# Altium schematic sheet Connectors_1.SchDoc: Extension connectors
size A3; DocumentNumber: MB1137; Revision: B-01; SheetNumber: 6; SheetTotal: 6; Project: NUCLEO-XXXXZX
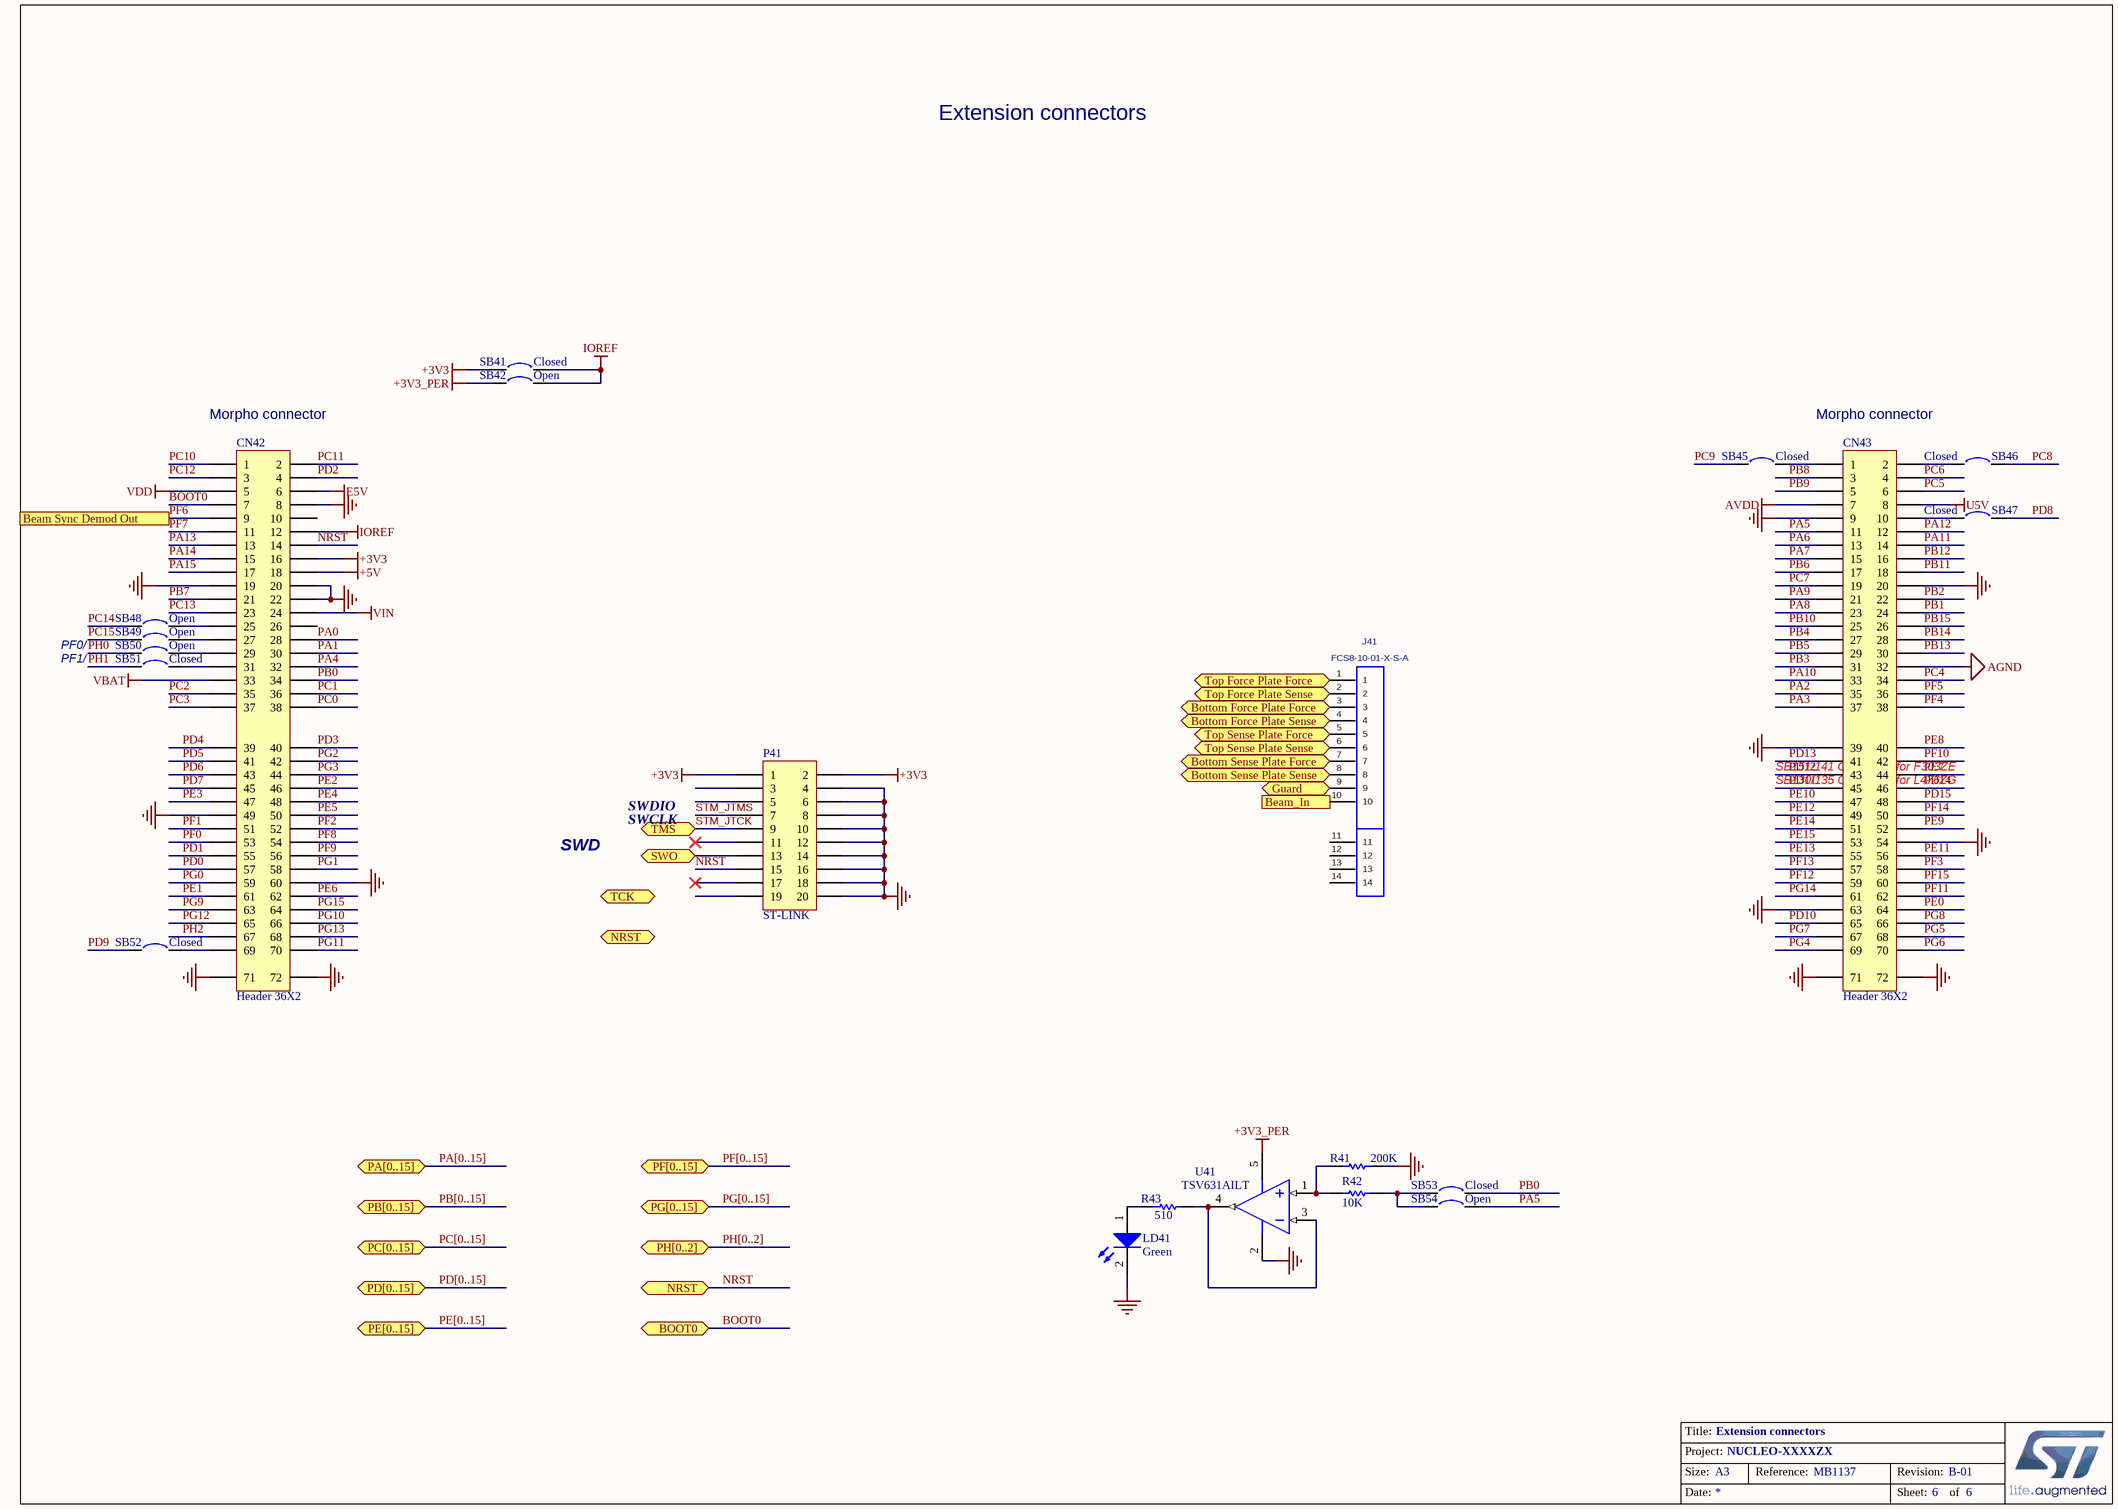
[diagram p0: Connectors_1.SchDoc]

## Parts
CN42  Header 36X2  [HDR_2x36_2R54_V_M]
CN43  Header 36X2  [HDR_2x36_2R54_V_M]
J41  FCS8-10-01-X-S-A  [FCS8-10-01-X-S-A]
LD41  Green  [0603D-G]
P41  ST-LINK  [HDR2X10]
R41  200K  [0603R]
R42  10K  [0603R]
R43  510  [0603R]
SB41  Closed  [SB_0603]
SB42  Open  [SB_0603]
SB45  Closed  [SB_0603]
SB46  Closed  [SB_0603]
SB47  Closed  [SB_0603]
SB48  Open  [SB_0603]
SB49  Open  [SB_0603]
SB50  Open  [SB_0603]
SB51  Closed  [SB_0603]
SB52  Closed  [SB_0603]
SB53  Closed  [SB_0603]
SB54  Open  [SB_0603]
U41  TSV631AILT  [SOT-23-5L]

## Ports
Beam Sync Demod Out, Beam_In, BOOT0, Bottom Force Plate Force, Bottom Force Plate Sense, Bottom Sense Plate Force, Bottom Sense Plate Sense, Guard, NRST, PA[0..15] (bidir), PB[0..15] (bidir), PC[0..15] (bidir), PD[0..15] (bidir), PE[0..15] (bidir), PF[0..15] (bidir), PG[0..15] (bidir), PH[0..2] (bidir), SWO, TCK, TMS, Top Force Plate Force, Top Force Plate Sense, Top Sense Plate Force, Top Sense Plate Sense

## Nets
+3V3: CN42.16 P41.1 P41.2 SB41.1
+3V3_PER: SB42.1 U41.5(VCC)
+5V: CN42.18
AGND: CN43.32
AVDD: CN43.7
E5V: CN42.6
GND: CN42.8 CN42.19 CN42.20 CN42.22 CN42.49 CN42.60 CN42.71 CN42.72 CN43.9 CN43.20 CN43.39 CN43.54 CN43.63 CN43.71 CN43.72 LD41.2(K) P41.4 P41.6 P41.8 P41.10 P41.12 P41.14 P41.16 P41.18 P41.20 R41.2 U41.2(VDD)
IOREF: CN42.12 SB41.2 SB42.2
U5V: CN43.8
VBAT: CN42.33
VDD: CN42.5
VIN: CN42.24
Beam_In: J41.10 ; port Beam_In
BOOT0: CN42.7 ; port BOOT0
Bottom Force Plate Force: J41.3 ; port Bottom Force Plate Force
Bottom Force Plate Sense: J41.4 ; port Bottom Force Plate Sense
Bottom Sense Plate Force: J41.7 ; port Bottom Sense Plate Force
Bottom Sense Plate Sense: J41.8 ; port Bottom Sense Plate Sense
Guard: J41.9 ; port Guard
NRST: CN42.14 P41.15 ; port NRST
PA0: CN42.28
PA1: CN42.30
PA2: CN43.35
PA3: CN43.37
PA4: CN42.32
PA5: CN43.11 SB54.2
PA6: CN43.13
PA7: CN43.15
PA8: CN43.23
PA9: CN43.21
PA10: CN43.33
PA11: CN43.14
PA12: CN43.12
PA13: CN42.13
PA14: CN42.15
PA15: CN42.17
PB0: CN42.34 SB53.1
PB1: CN43.24
PB2: CN43.22
PB3: CN43.31
PB4: CN43.27
PB5: CN43.29
PB6: CN43.17
PB7: CN42.21
PB8: CN43.3
PB9: CN43.5
PB10: CN43.25
PB11: CN43.18
PB12: CN43.16
PB13: CN43.30
PB14: CN43.28
PB15: CN43.26
PC0: CN42.38
PC1: CN42.36
PC2: CN42.35
PC3: CN42.37
PC4: CN43.34
PC5: CN43.6
PC6: CN43.4
PC7: CN43.19
PC8: SB46.1
PC9: SB45.1
PC10: CN42.1
PC11: CN42.2
PC12: CN42.3
PC13: CN42.23
PC14: SB48.1
PC15: SB49.1
PD0: CN42.57
PD1: CN42.55
PD2: CN42.4
PD3: CN42.40
PD4: CN42.39
PD5: CN42.41
PD6: CN42.43
PD7: CN42.45
PD8: SB47.2
PD9: SB52.1
PD10: CN43.65
PD11: CN43.45
PD12: CN43.43
PD13: CN43.41
PD14: CN43.46
PD15: CN43.48
PE0: CN43.64
PE1: CN42.61
PE2: CN42.46
PE3: CN42.47
PE4: CN42.48
PE5: CN42.50
PE6: CN42.62
PE7: CN43.44
PE8: CN43.40
PE9: CN43.52
PE10: CN43.47
PE11: CN43.56
PE12: CN43.49
PE13: CN43.55
PE14: CN43.51
PE15: CN43.53
PF0: CN42.53
PF1: CN42.51
PF2: CN42.52
PF3: CN43.58
PF4: CN43.38
PF5: CN43.36
PF6: CN42.9 ; port Beam Sync Demod Out
PF7: CN42.11
PF8: CN42.54
PF9: CN42.56
PF10: CN43.42
PF11: CN43.62
PF12: CN43.59
PF13: CN43.57
PF14: CN43.50
PF15: CN43.60
PG0: CN42.59
PG1: CN42.58
PG2: CN42.42
PG3: CN42.44
PG4: CN43.69
PG5: CN43.68
PG6: CN43.70
PG7: CN43.67
PG8: CN43.66
PG9: CN42.63
PG10: CN42.66
PG11: CN42.70
PG12: CN42.65
PG13: CN42.68
PG14: CN43.61
PG15: CN42.64
PH0: SB50.1
PH1: SB51.1
PH2: CN42.67
STM_JTCK: P41.9 ; port TMS
STM_JTMS: P41.7
SWO: P41.13 ; port SWO
Top Force Plate Force: J41.1 ; port Top Force Plate Force
Top Force Plate Sense: J41.2 ; port Top Force Plate Sense
Top Sense Plate Force: J41.5 ; port Top Sense Plate Force
Top Sense Plate Sense: J41.6 ; port Top Sense Plate Sense
NetCN42_25: CN42.25 SB48.2
NetCN42_27: CN42.27 SB49.2
NetCN42_29: CN42.29 SB50.2
NetCN42_31: CN42.31 SB51.2
NetCN42_69: CN42.69 SB52.2
NetCN43_1: CN43.1 SB45.2
NetCN43_2: CN43.2 SB46.2
NetCN43_10: CN43.10 SB47.1
NetLD41_1: LD41.1(A) R43.2
NetR41_1: R41.1 R42.1 U41.1(IN+)
NetR42_2: R42.2 SB53.2 SB54.1
NetR43_1: R43.1 U41.3(IN-) U41.4(OUT)

Not connected (* = marked no-connect by the designer): CN42 10 26; J41 11 12 13 14; P41 3 5 11* 17* 19

## Buses and harness runs
bus PA[0..15] = port PA[0..15]
bus PB[0..15] = port PB[0..15]
bus PC[0..15] = port PC[0..15]
bus PD[0..15] = port PD[0..15]
bus PE[0..15] = port PE[0..15]
bus PF[0..15] = port PF[0..15]
bus PG[0..15] = port PG[0..15]
bus PH[0..2] = port PH[0..2]

## Notes on the sheet
- Extension connectors
- (near CN42) Morpho connector
- Morpho connector
- PF0/
- PF1/
- SB151/141 Close only for F303ZE
- SB130/135 Close only for L476ZG
- (near CN42) /PH1
- (near CN42) /PH0
- SWD
- SWCLK
- SWDIO
- Title:
- Project:
- Size:
- Date:
- A3
- Reference:
- Sheet:
- Revision:
- of

## Library data of the parts
CN42 CN43 = Header 36X2: Header, 36-Pin, Dual row; Revision: 17-Jul-2002: Re-released for DXP Platform.; Publisher: Altium Limited
J41 = FCS8-10-01-X-S-A: FCS8 Socket Assembly, 20-Pins, w/ Alignment Pins; MANUFACTURER: SAMTEC; CREATED: 31 NOV 2013 - WENDY XIN; PCB DECAL: FCS8-10-01-X-S-A
LD41 = LED2: Typical RED, GREEN, YELLOW, AMBER GaAs LED; Published: 8-Jun-2000; Revision: July-2002: Re-released for DXP Platform.; Publisher: Altium Limited
P41 = Header 10X2: Header, 10-Pin, Dual row; LatestRevisionDate: 17-Jul-2002; LatestRevisionNote: Re-released for DXP Platform.; Publisher: Altium Limited
R41 R42 = res1: Resistor; Value: 1K; Published: 8-Jun-2000; Revision: July-2002: Re-released for DXP Platform.; Publisher: Altium Limited
R43 = Res1: Resistor; Value: 1K; Published: 8-Jun-2000; Revision: July-2002: Re-released for DXP Platform.; Publisher: Altium Limited
SB41 SB45-SB47 SB51-SB53 = Circuit Breaker_close: Circuit Breaker; Published: 24-Mar-1999; Revision: July-2002: Re-released for DXP Platform.; Publisher: Altium Limited
SB42 SB48-SB50 SB54 = Circuit Breaker: Published: 24-Mar-1999; Revision: July-2002: Re-released for DXP Platform.; Publisher: Altium Limited